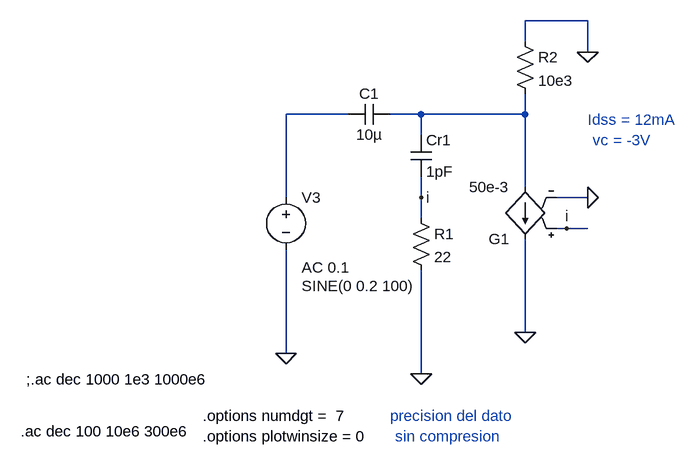
[diagram p0: schematic reactancia.asc]
reactancia.asc, the LTspice schematic file:
Version 4
SHEET 1 880 680
WIRE 352 -192 256 -192
WIRE 256 -160 256 -192
WIRE 352 -144 352 -192
WIRE -16 -48 -112 -48
WIRE 96 -48 48 -48
WIRE 256 -48 256 -80
WIRE 256 -48 96 -48
WIRE 96 -16 96 -48
WIRE 256 64 256 -48
WIRE -112 80 -112 -48
WIRE 96 80 96 48
WIRE 352 80 304 80
WIRE 96 112 96 80
WIRE 320 128 304 128
WIRE 352 128 320 128
WIRE 256 288 256 144
WIRE -112 320 -112 160
WIRE 96 352 96 192
FLAG 96 352 0
FLAG -112 320 0
FLAG 96 80 i
FLAG 256 288 0
FLAG 352 80 0
FLAG 320 128 i
FLAG 352 -144 0
SYMBOL cap 80 -16 R0
SYMATTR InstName Cr1
SYMATTR Value 1pF
SYMBOL res 80 96 R0
SYMATTR InstName R1
SYMATTR Value 22
SYMBOL cap -16 -32 R270
WINDOW 0 32 32 VTop 2
WINDOW 3 0 32 VBottom 2
SYMATTR InstName C1
SYMATTR Value 10µ
SYMBOL voltage -112 64 R0
WINDOW 3 24 152 Left 2
WINDOW 123 24 124 Left 2
WINDOW 39 0 0 Left 0
SYMATTR Value SINE(0 0.2 100)
SYMATTR Value2 AC 0.1
SYMATTR InstName V3
SYMBOL g 256 160 R180
SYMATTR InstName G1
SYMATTR Value 50e-3
SYMBOL res 240 -176 R0
SYMATTR InstName R2
SYMATTR Value 10e3
TEXT -520 440 Left 2 !.ac dec 100 10e6 300e6
TEXT 352 -40 Left 2 ;Idss = 12mA
TEXT 360 -8 Left 2 ;vc = -3V
TEXT -240 416 Left 2 !.options numdgt =  7
TEXT -240 448 Left 2 !.options plotwinsize = 0
TEXT 48 416 Left 2 ;precision del dato
TEXT 56 448 Left 2 ;sin compresion
TEXT -512 360 Left 2 !;.ac dec 1000 1e3 1000e6

The netlist it stands for:
* reactancia.asc
Cr1 N002 i 1pF
R1 i 0 22
C1 N001 N002 10µ
V3 N001 0 SINE(0 0.2 100) AC 0.1
G1 N002 0 i 0 50e-3
R2 0 N002 10e3
.ac dec 100 10e6 300e6
* Idss = 12mA
* vc = -3V
.options numdgt =  7
.options plotwinsize = 0
* precision del dato
* sin compresion
;.ac dec 1000 1e3 1000e6
.backanno
.end